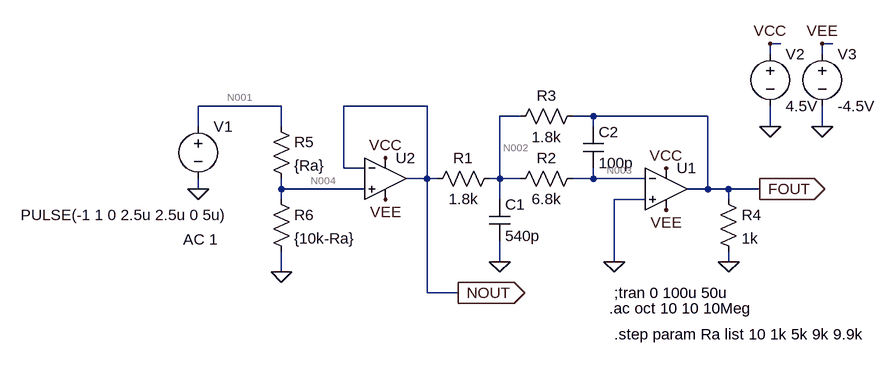
[diagram p0: schematic 2nd MFB with POT Buffer.asc]
2nd MFB with POT Buffer.asc, the LTspice schematic file:
Version 4
SHEET 1 880 680
WIRE 240 -64 224 -64
WIRE 320 -64 304 -64
WIRE 224 -48 224 -64
WIRE 304 -48 304 -64
WIRE -528 32 -656 32
WIRE -304 32 -432 32
WIRE -160 48 -192 48
WIRE -48 48 -80 48
WIRE 128 48 -48 48
WIRE -656 64 -656 32
WIRE -528 64 -528 32
WIRE -48 64 -48 48
WIRE 224 64 224 32
WIRE 304 64 304 32
WIRE -432 128 -432 32
WIRE -400 128 -432 128
WIRE -304 144 -304 32
WIRE -304 144 -336 144
WIRE -288 144 -304 144
WIRE -192 144 -192 48
WIRE -192 144 -208 144
WIRE -160 144 -192 144
WIRE -48 144 -48 128
WIRE -48 144 -80 144
WIRE 32 144 -48 144
WIRE -656 160 -656 144
WIRE -528 160 -528 144
WIRE -400 160 -528 160
WIRE 128 160 128 48
WIRE 128 160 96 160
WIRE 160 160 128 160
WIRE 208 160 160 160
WIRE -528 176 -528 160
WIRE -192 176 -192 144
WIRE 32 176 -16 176
WIRE 160 176 160 160
WIRE -192 272 -192 240
WIRE -16 272 -16 176
WIRE 160 272 160 256
WIRE -528 288 -528 256
WIRE -304 320 -304 144
WIRE -256 320 -304 320
FLAG -656 160 0
FLAG -192 272 0
FLAG -16 272 0
FLAG 224 64 0
FLAG 304 64 0
FLAG 224 -64 VCC
FLAG 304 -64 VEE
FLAG 64 128 VCC
FLAG 64 192 VEE
FLAG 160 272 0
FLAG 208 160 FOUT
IOPIN 208 160 Out
FLAG -528 288 0
FLAG -368 112 VCC
FLAG -368 176 VEE
FLAG -256 320 NOUT
IOPIN -256 320 Out
SYMBOL res -192 128 R90
WINDOW 0 0 56 VBottom 2
WINDOW 3 32 56 VTop 2
SYMATTR InstName R1
SYMATTR Value 1.8k
SYMBOL res -64 128 R90
WINDOW 0 0 56 VBottom 2
WINDOW 3 32 56 VTop 2
SYMATTR InstName R2
SYMATTR Value 6.8k
SYMBOL res -64 32 R90
WINDOW 0 0 56 VBottom 2
WINDOW 3 32 56 VTop 2
SYMATTR InstName R3
SYMATTR Value 1.8k
SYMBOL cap -208 176 R0
SYMATTR InstName C1
SYMATTR Value 540p
SYMBOL cap -64 64 R0
SYMATTR InstName C2
SYMATTR Value 100p
SYMBOL voltage -656 48 R0
WINDOW 3 -273 152 Left 2
WINDOW 123 -23 190 Left 2
WINDOW 39 0 0 Left 2
SYMATTR Value PULSE(-1 1 0 2.5u 2.5u 0 5u)
SYMATTR Value2 AC 1
SYMATTR InstName V1
SYMBOL voltage 224 -64 R0
WINDOW 123 0 0 Left 2
WINDOW 39 0 0 Left 2
SYMATTR InstName V2
SYMATTR Value 4.5V
SYMBOL voltage 304 -64 R0
WINDOW 123 0 0 Left 2
WINDOW 39 0 0 Left 2
SYMATTR InstName V3
SYMATTR Value -4.5V
SYMBOL Opamps\\UniversalOpamp2 64 160 R0
SYMATTR InstName U1
SYMBOL res 144 160 R0
SYMATTR InstName R4
SYMATTR Value 1k
SYMBOL res -544 48 R0
SYMATTR InstName R5
SYMATTR Value {Ra}
SYMBOL res -544 160 R0
SYMATTR InstName R6
SYMATTR Value {10k-Ra}
SYMBOL Opamps\\UniversalOpamp2 -368 144 R0
SYMATTR InstName U2
TEXT -16 320 Left 2 !;tran 0 100u 50u
TEXT -24 344 Left 2 !.ac oct 10 10 10Meg
TEXT -16 384 Left 2 !.step param Ra list 10 1k 5k 9k 9.9k

The netlist it stands for:
* 2nd MFB with POT Buffer.asc
R1 N002 NOUT 1.8k
R2 N003 N002 6.8k
R3 FOUT N002 1.8k
C1 N002 0 540p
C2 FOUT N003 100p
V1 N001 0 PULSE(-1 1 0 2.5u 2.5u 0 5u) AC 1
V2 VCC 0 4.5V
V3 VEE 0 -4.5V
XU1 0 N003 VCC VEE FOUT level.2 Avol=1Meg GBW=10Meg Slew=10Meg ilimit=25m rail=0 Vos=0 phimargin=45 en=0 enk=0 in=0 ink=0 Rin=500Meg  ; pins IN+ IN- V+ V- OUT
R4 FOUT 0 1k
R5 N001 N004 {Ra}
R6 N004 0 {10k-Ra}
XU2 N004 NOUT VCC VEE NOUT level.2 Avol=1Meg GBW=10Meg Slew=10Meg ilimit=25m rail=0 Vos=0 phimargin=45 en=0 enk=0 in=0 ink=0 Rin=500Meg  ; pins IN+ IN- V+ V- OUT
;tran 0 100u 50u
.ac oct 10 10 10Meg
.step param Ra list 10 1k 5k 9k 9.9k
.lib UniversalOpamps2.sub
.backanno
.end

* Results of the author's LTspice run, read from the files saved beside the schematic
* Operating Point (first step), zero values left out:
*   ra = 10 
*   V(n002) = -1.036 µV
*   V(nout) = -999 mV
*   V(n003) = -1.036 µV
*   V(fout) = 999 mV
*   V(n001) = -1 V
*   V(vcc) = 4.5 V
*   V(vee) = -4.5 V
*   V(n004) = -999 mV
*   I(R6) = -100 µA
*   I(R5) = -100 µA
*   I(R4) = 999 µA
*   I(R3) = 555 µA
*   I(R1) = 555 µA
*   I(V3) = 911.8 µA
*   I(V2) = -1.911 mA
*   I(V1) = 100 µA
*   Ix(u1:3) = 1.669 mA
*   Ix(u1:4) = -115.2 µA
*   Ix(u1:5) = -1.554 mA
*   Ix(u2:1) = -1.998 nA
*   Ix(u2:2) = -1.998 nA
*   Ix(u2:3) = 241.6 µA
*   Ix(u2:4) = -796.6 µA
*   Ix(u2:5) = 555 µA
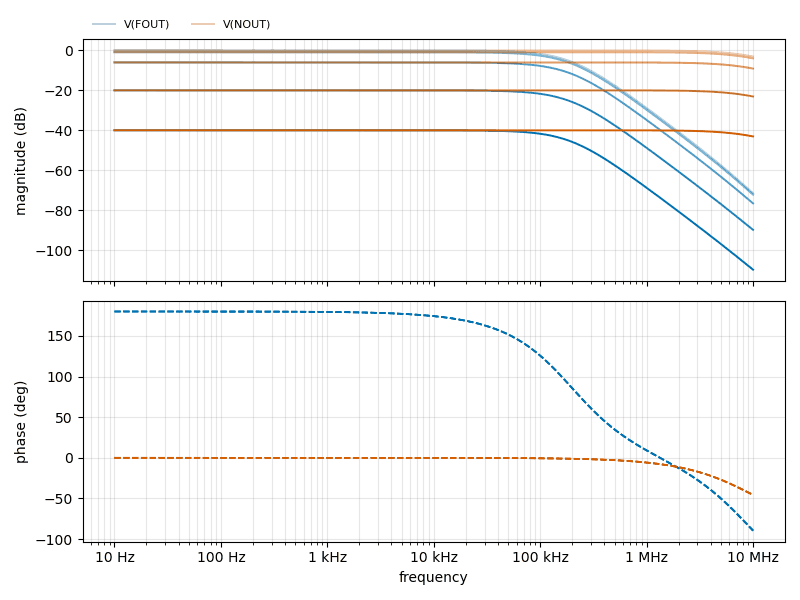
[diagram p1: AC Analysis of 2nd MFB with POT Buffer.asc, plotted from the saved traces]
* AC Analysis, 5 runs:
*   V(FOUT) [run 1]: -0.01 dB at 10 Hz, -71.52 dB at 10 MHz, peak -0.01 dB at 10 Hz, 3 dB below the peak at 134.6 kHz
*   V(FOUT) [run 2]: -0.92 dB at 10 Hz, -72.28 dB at 10 MHz, peak -0.92 dB at 10 Hz, 3 dB below the peak at 134.6 kHz
*   V(FOUT) [run 3]: -6.02 dB at 10 Hz, -76.62 dB at 10 MHz, peak -6.02 dB at 10 Hz, 3 dB below the peak at 134.6 kHz
*   V(FOUT) [run 4]: -20.00 dB at 10 Hz, -89.86 dB at 10 MHz, peak -20.00 dB at 10 Hz, 3 dB below the peak at 134.6 kHz
*   V(FOUT) [run 5]: -40.00 dB at 10 Hz, -109.82 dB at 10 MHz, peak -40.00 dB at 10 Hz, 3 dB below the peak at 134.6 kHz
*   V(NOUT) [run 1]: -0.01 dB at 10 Hz, -3.09 dB at 10 MHz, peak -0.01 dB at 10 Hz, 3 dB below the peak at 9.844 MHz
*   V(NOUT) [run 2]: -0.92 dB at 10 Hz, -3.99 dB at 10 MHz, peak -0.92 dB at 10 Hz, 3 dB below the peak at 9.845 MHz
*   V(NOUT) [run 3]: -6.02 dB at 10 Hz, -9.10 dB at 10 MHz, peak -6.02 dB at 10 Hz, 3 dB below the peak at 9.845 MHz
*   V(NOUT) [run 4]: -20.00 dB at 10 Hz, -23.08 dB at 10 MHz, peak -20.00 dB at 10 Hz, 3 dB below the peak at 9.845 MHz
*   V(NOUT) [run 5]: -40.00 dB at 10 Hz, -43.08 dB at 10 MHz, peak -40.00 dB at 10 Hz, 3 dB below the peak at 9.845 MHz